# EAGLE board Yantronix_ECG_Alpha (EAGLE 5.10)
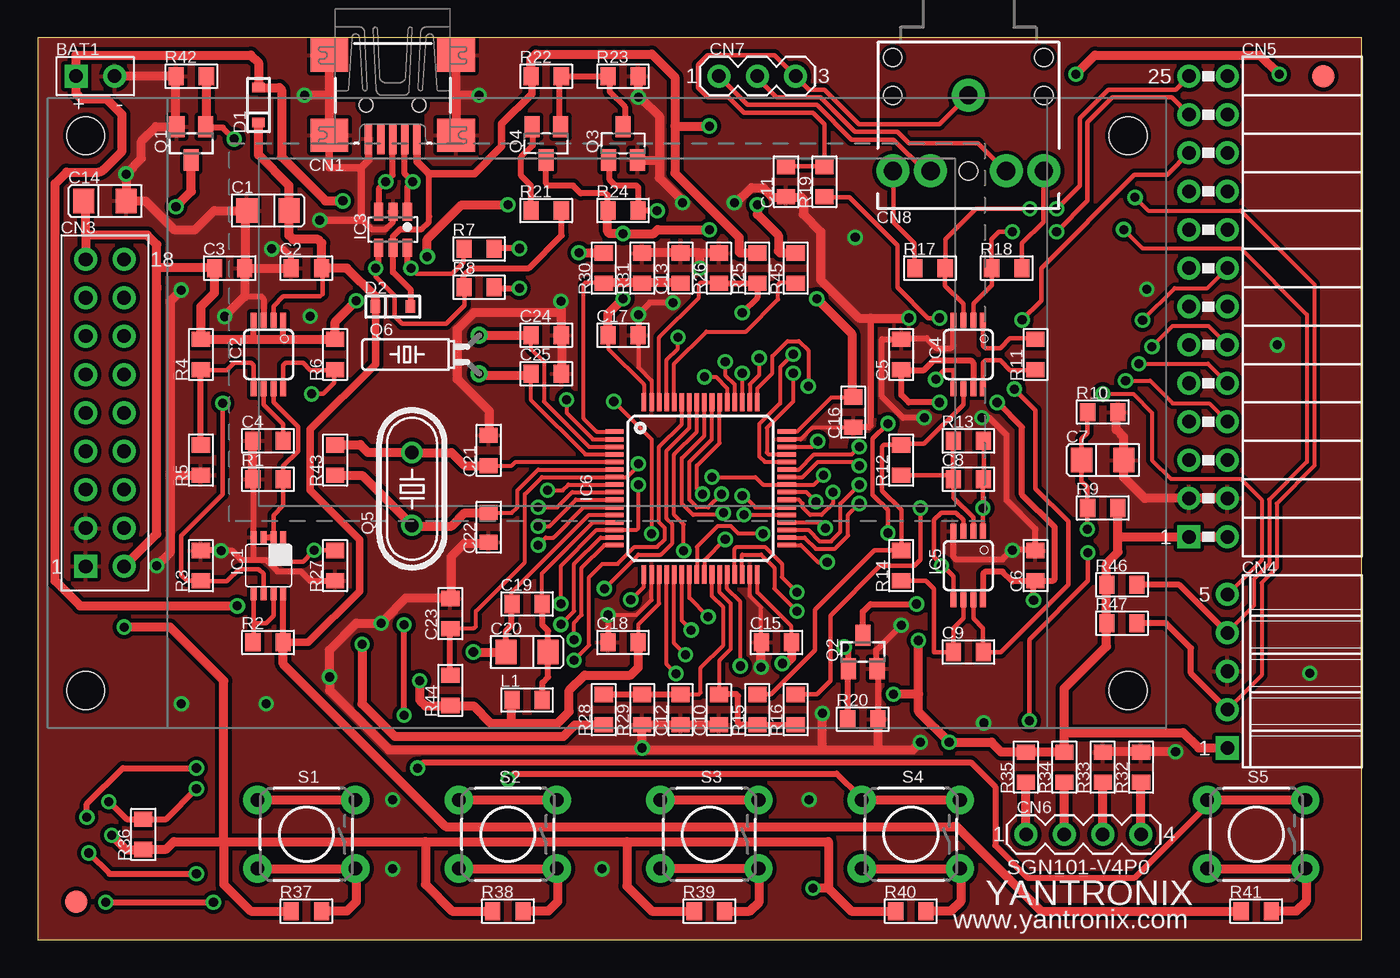
[diagram p2: board, top side]
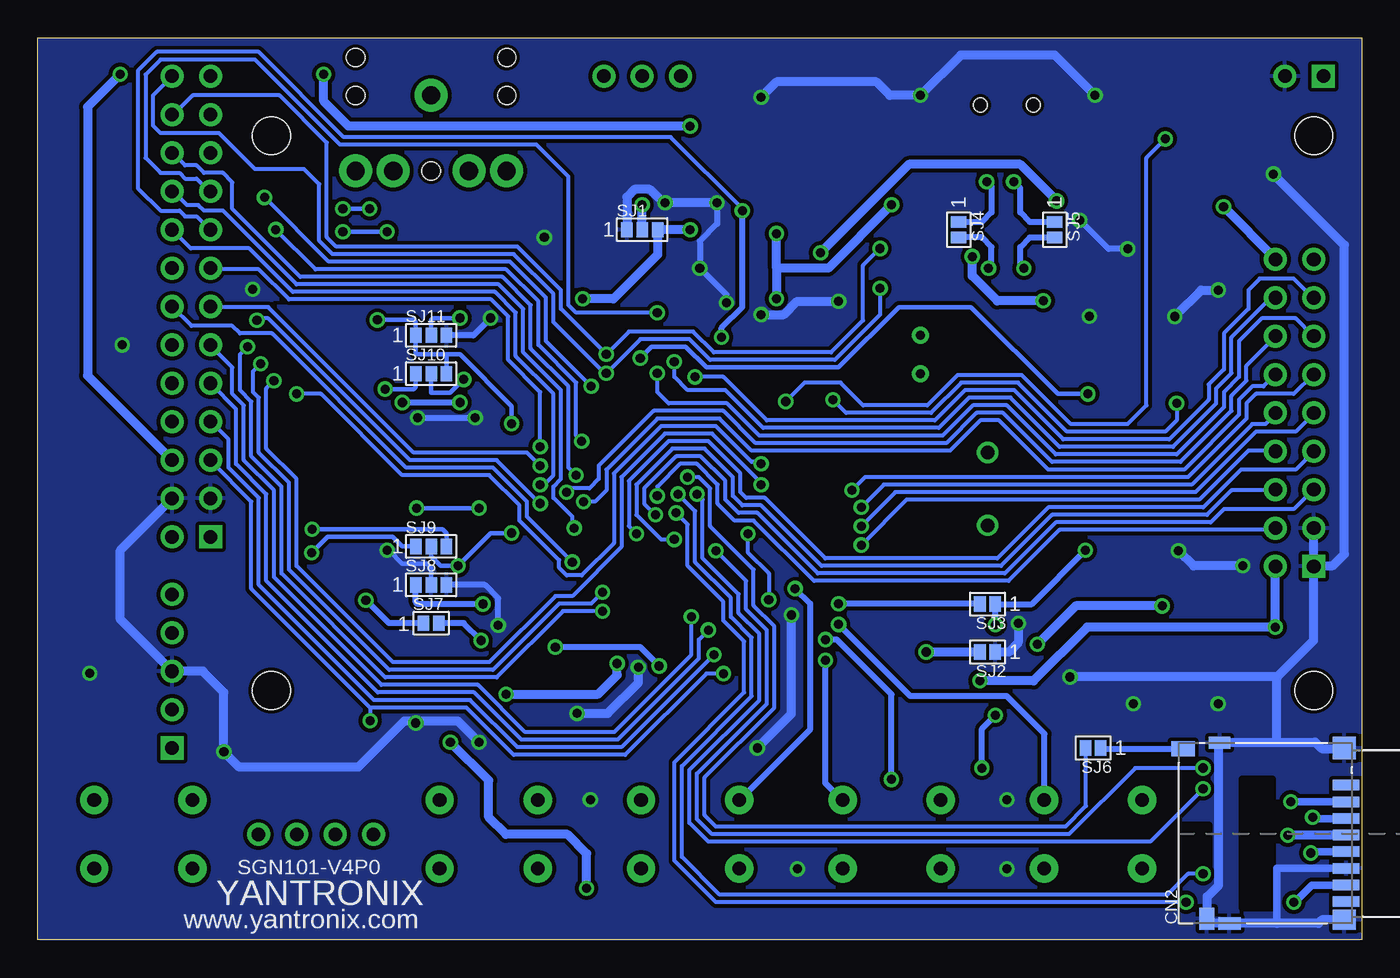
[diagram p3: board, bottom side, seen from below]

Size 87.63 x 59.69 mm. Coordinates in mm from the lower left corner, seen from the top.
Outline: 0,0 87.63,0 87.63,59.69 0,59.69 0,0
Copper layers (1*16): Top 0.035mm / dielectric 1.5mm / Bottom 0.035mm
Design rules "default *": minimum track width 10mil, minimum drill 0.6mm, track to track 8mil, track to pad 8mil, pad to pad 7mil, via to via 8mil, smd to smd 8mil, copper to edge 0mil, drill to drill 8mil, minimum pad ring 10mil, minimum via ring 8mil, stop-mask expansion 4mil, vias tented up to drill 0mil, thermal gap 10mil

## Footprints (pad centres in the part's own frame; a part is rotated, then mirrored left to right if it is on the bottom)
BATTERY = drill 0.9 pad 1.524 square: + 0,1.27 | drill 0.9 pad 1.524 round: - 0,-1.27
EIA3216 = smd 1.4 x 1.6: A 1.4,0; C -1.4,0
0805 = smd 1 x 1.2: 1 -1,0; 2 1,0
UX60-MB-5ST = smd 2 x 0.5: 1 2.25,1.6; 2 2.25,0.8; 3 2.25,0; 4 2.25,-0.8; 5 2.25,-1.6 | smd 2.2 x 2.5: M1 -3.3,-4.2; M2 -3.3,4.2; M3 2,4.2; M4 2,-4.2 | hole 0.9: 0,-1.75; 0,1.75
MICROSD-CONN-PUSH-PULL = smd 0.7 x 1.75: 1 7.7,-0.875; 2 6.6,-0.875; 3 5.5,-0.875; 4 4.4,-0.875; 5 3.3,-0.875; 6 2.2,-0.875; 7 1.1,-0.875; 8 0,-0.875 | smd 1.5 x 1.5: GND1 10.15,-0.75 | smd 1.3 x 1.5: GND2 -1.2,-0.75 | smd 0.8 x 1.4: GND3 10.5,7.5 | smd 0.8 x 1.5: GND4 -1.45,6.85 | smd 1 x 1.55: SW1 10.1,9.925 | smd 1.45 x 1: SW2 -1.125,8.35
LCD-CONN-128X64 = drill 0.9 pad 1.524 square: 1 0,8.2 | drill 0.9 pad 1.524 round: 2 2.54,8.2; 3 0,10.74; 4 2.54,10.74; 5 0,13.28; 6 2.54,13.28; 7 0,15.82; 8 2.54,15.82; 9 0,18.36; 10 2.54,18.36; 11 0,20.9; 12 2.54,20.9; 13 0,23.44; 14 2.54,23.44; 15 0,25.98; 16 2.54,25.98; 17 0,28.52; 18 2.54,28.52 | hole 2.5: 0,0; 69,0; 0,36.7; 69,36.7
FE05W = drill 0.9 pad 1.524 square: 1 5.08,0 | drill 0.9 pad 1.524 round: 2 2.54,0; 3 0,0; 4 -2.54,0; 5 -5.08,0
FE13-2W = drill 0.9 pad 1.524 square: 1 -15.24,1.27 | drill 0.9 pad 1.524 round: 2 -15.24,-1.27; 3 -12.7,1.27; 4 -12.7,-1.27; 5 -10.16,1.27; 6 -10.16,-1.27; 7 -7.62,1.27; 8 -7.62,-1.27; 9 -5.08,1.27; 10 -5.08,-1.27; 11 -2.54,1.27; 12 -2.54,-1.27; 13 0,1.27; 14 0,-1.27; 15 2.54,1.27; 16 2.54,-1.27; 17 5.08,1.27; 18 5.08,-1.27; 19 7.62,1.27; 20 7.62,-1.27; 21 10.16,1.27; 22 10.16,-1.27; 23 12.7,1.27; 24 12.7,-1.27; 25 15.24,1.27; 26 15.24,-1.27
MA04-1 = drill 0.9 pad 1.524 round: 1 -3.81,0; 2 -1.27,0; 3 1.27,0; 4 3.81,0
MA03-1 = drill 0.9 pad 1.524 round: 1 -2.54,0; 2 0,0; 3 2.54,0
AUDIO-JACK = drill 1.2 pad 2.184 round: 1 0,0; 2 5,-5; 3 5,5; 4 5,-2.5; 5 5,2.5 | hole 1.2: 0,5; -2.5,5; -2.5,-5; 0,-5; 5,0
SOD-323 = smd 0.63 x 0.83: A 1.15,0; K -1.15,0
DCT_R-PDSO-G8 = smd 0.4 x 0.8: 1 -0.975,-1.875; 2 -0.325,-1.875; 3 0.325,-1.875; 4 0.975,-1.875; 5 0.975,1.875; 6 0.325,1.875; 7 -0.325,1.875; 8 -0.975,1.875
MSOP08 = smd 0.4 x 1: 1 -0.976,-2.263; 2 -0.326,-2.263; 3 0.324,-2.263; 4 0.974,-2.263; 5 0.974,2.262; 6 0.324,2.262; 7 -0.326,2.262; 8 -0.976,2.262
SOT23-6 = smd 0.6 x 1.2: 1 -0.95,-1.2; 2 0,-1.2; 3 0.95,-1.2; 4 0.95,1.2; 5 0,1.2; 6 -0.95,1.2
TQFP64 = smd 1.2 x 0.3: 1 -5.7,3.75; 2 -5.7,3.25; 3 -5.7,2.75; 4 -5.7,2.25; 5 -5.7,1.75; 6 -5.7,1.25; 7 -5.7,0.75; 8 -5.7,0.25; 9 -5.7,-0.25; 10 -5.7,-0.75; 11 -5.7,-1.25; 12 -5.7,-1.75; 13 -5.7,-2.25; 14 -5.7,-2.75; 15 -5.7,-3.25; 16 -5.7,-3.75; 33 5.7,-3.75; 34 5.7,-3.25; 35 5.7,-2.75; 36 5.7,-2.25; 37 5.7,-1.75; 38 5.7,-1.25; 39 5.7,-0.75; 40 5.7,-0.25; 41 5.7,0.25; 42 5.7,0.75; 43 5.7,1.25; 44 5.7,1.75; 45 5.7,2.25; 46 5.7,2.75; 47 5.7,3.25; 48 5.7,3.75 | smd 0.3 x 1.2: 17 -3.75,-5.7; 18 -3.25,-5.7; 19 -2.75,-5.7; 20 -2.25,-5.7; 21 -1.75,-5.7; 22 -1.25,-5.7; 23 -0.75,-5.7; 24 -0.25,-5.7; 25 0.25,-5.7; 26 0.75,-5.7; 27 1.25,-5.7; 28 1.75,-5.7; 29 2.25,-5.7; 30 2.75,-5.7; 31 3.25,-5.7; 32 3.75,-5.7; 49 3.75,5.7; 50 3.25,5.7; 51 2.75,5.7; 52 2.25,5.7; 53 1.75,5.7; 54 1.25,5.7; 55 0.75,5.7; 56 0.25,5.7; 57 -0.25,5.7; 58 -0.75,5.7; 59 -1.25,5.7; 60 -1.75,5.7; 61 -2.25,5.7; 62 -2.75,5.7; 63 -3.25,5.7; 64 -3.75,5.7
FIDUCIAL-1.5X3 = smd 1.5 x 1.5: 1 0,0
SOT23 = smd 1 x 1.4: 1 -0.95,-1.1; 2 0.95,-1.1; 3 0,1.1
SOT23-BEC = smd 1 x 1.4: B -0.95,-1.1; C 0,1.1; E 0.95,-1.1
HC49/S = drill 0.9 round: 1 -2.413,0; 2 2.413,0
TC26H = drill 0.6 round: 1 -1.27,0; 2 1.27,0
TACTILE-PTH = drill 0.9 pad 1.88 round: 1 -3.251,2.261; 2 3.251,2.261; 3 -3.251,-2.261; 4 3.251,-2.261
SJ-2 = smd 0.762 x 1.016: 1 -1.016,0; 2 0,0; 3 1.016,0
SJ = smd 0.762 x 1.016: 1 -0.508,0; 2 0.508,0

## Placement (x,y rotation side)
BAT1  BATTERY  [BATTERY]  3.81,57.15 90 top
C1  10uF  [EIA3216]  15.24,48.26 0 top
C2  2.2uF  [0805]  17.78,44.45 180 top
C3  2.2uF  [0805]  12.7,44.45 0 top
C4  33nF  [0805]  15.24,33.02 180 top
C5  0.1uF  [0805]  57.15,38.73 90 top
C6  0.1uF  [0805]  66.04,24.77 90 top
C7  10uF  [EIA3216]  70.48,31.75 180 top
C8  0.01uF  [0805]  61.59,30.48 0 top
C9  0.1uF  [0805]  61.59,19.05 180 top
C10  0.1uF  [0805]  45.09,15.24 90 top
C11  0.1uF  [0805]  49.53,50.16 90 top
C12  0.1uF  [0805]  42.55,15.24 270 top
C13  0.1uF  [0805]  42.55,44.45 90 top
C14  10uF  [EIA3216]  4.45,48.9 180 top
C15  0.1uF  [0805]  48.9,19.68 180 top
C16  0.1uF  [0805]  53.98,34.92 270 top
C17  0.1uF  [0805]  38.73,40.01 0 top
C18  0.1uF  [0805]  38.73,19.68 180 top
C19  0.1uF  [0805]  32.38,22.23 180 top
C20  10uF  [EIA3216]  32.38,19.05 0 top
C21  27pF  [0805]  29.84,32.38 90 top
C22  27pF  [0805]  29.84,27.3 270 top
C23  0.1uF  [0805]  27.3,21.59 90 top
C24  6.8pF  [0805]  33.66,40.01 0 top
C25  6.8pF  [0805]  33.66,37.47 0 top
CN1  MINI-USB-SHIELD-UX60-MB-5ST  [UX60-MB-5ST]  23.5,55.24 270 top
CN2  DM3D-SF  [MICROSD-CONN-PUSH-PULL]  1.91,2.54 90 bottom
CN3  PL-E128649B  [LCD-CONN-128X64]  3.17,16.51 0 top
CN4  SWD  [FE05W]  78.74,17.78 270 top
CN5  EXT-CON  [FE13-2W]  77.47,41.91 90 top
CN6  PU-PD  [MA04-1]  69.22,6.99 0 top
CN7  RA-LA-RL  [MA03-1]  47.62,57.15 0 top
CN8  AUDIO-JACKPTH  [AUDIO-JACK]  61.59,55.88 270 top
D1  BAT60J  [SOD-323]  14.61,55.24 90 top
D2  BAT60J  [SOD-323]  23.5,41.91 0 top
IC1  SN74LVC2G02  [DCT_R-PDSO-G8]  15.28,24.77 180 top
IC2  LP3982IMM  [MSOP08]  15.28,38.73 180 top
IC3  USBLC6-2SC6  [SOT23-6]  23.51,46.99 180 top
IC4  AD623RM  [MSOP08]  61.59,38.73 180 top
IC5  AD8607RM  [MSOP08]  61.59,24.77 180 top
IC6  STM32F10XRXT6  [TQFP64]  43.88,29.88 0 top
JP1  FIDUCIAL1.5X3  [FIDUCIAL-1.5X3]  2.54,2.54 0 top
JP2  FIDUCIAL1.5X3  [FIDUCIAL-1.5X3]  85.09,57.15 0 top
L1  Ferrite Bead  [0805]  32.38,15.88 0 top
Q1  BSS123  [SOT23]  10.16,52.7 180 top
Q2  BSS123  [SOT23]  54.61,19.05 0 top
Q3  BC817-40SMD  [SOT23-BEC]  38.73,52.7 0 top
Q4  BC817-40SMD  [SOT23-BEC]  33.66,52.7 180 top
Q5  8MHz  [HC49/S]  24.77,29.84 90 top
Q6  32KHz  [TC26H]  29.21,38.73 90 top
R1  100K  [0805]  15.24,30.48 0 top
R2  100K  [0805]  15.24,19.68 0 top
R3  100K  [0805]  10.79,24.77 270 top
R4  140K  [0805]  10.79,38.73 90 top
R5  100K  [0805]  10.79,31.75 90 top
R6  100K  [0805]  19.68,38.73 90 top
R7  22R  [0805]  29.21,45.72 0 top
R8  22R  [0805]  29.21,43.18 0 top
R9  100K  [0805]  70.48,28.57 0 top
R10  100K  [0805]  70.48,34.92 180 top
R11  10K  [0805]  66.04,38.73 90 top
R12  1K  [0805]  57.15,31.75 90 top
R13  100K  [0805]  61.59,33.02 0 top
R14  1M  [0805]  57.15,24.77 90 top
R15  OPEN  [0805]  47.62,15.24 90 top
R16  100R  [0805]  50.16,15.24 90 top
R17  100K  [0805]  59.05,44.45 0 top
R18  100K  [0805]  64.14,44.45 180 top
R19  100K  [0805]  52.07,50.16 270 top
R20  100K  [0805]  54.61,14.61 180 top
R21  1K5  [0805]  33.66,48.26 0 top
R22  10K  [0805]  33.66,57.15 0 top
R23  36K  [0805]  38.73,57.15 0 top
R24  47K  [0805]  38.73,48.26 180 top
R25  15K  [0805]  47.62,44.45 270 top
R26  22K  [0805]  45.09,44.45 90 top
R27  100K  [0805]  19.68,24.77 90 top
R28  1M  [0805]  37.47,15.24 270 top
R29  1M  [0805]  40.01,15.24 90 top
R30  330K  [0805]  37.47,44.45 90 top
R31  680K  [0805]  40.01,44.45 270 top
R32  330R  [0805]  73.03,11.43 270 top
R33  330R  [0805]  70.48,11.43 270 top
R34  10K  [0805]  67.94,11.43 90 top
R35  10K  [0805]  65.41,11.43 90 top
R36  10K  [0805]  6.99,6.99 270 top
R37  10K  [0805]  17.78,1.91 0 top
R38  10K  [0805]  31.11,1.91 0 top
R39  10K  [0805]  44.45,1.91 0 top
R40  10K  [0805]  57.78,1.91 0 top
R41  33K  [0805]  80.64,1.91 0 top
R42  100K  [0805]  10.16,57.15 0 top
R43  1M  [0805]  19.68,31.75 90 top
R44  100K  [0805]  27.3,16.51 270 top
R45  10K  [0805]  50.16,44.45 90 top
R46  10K  [0805]  71.75,23.5 180 top
R47  10K  [0805]  71.75,20.95 180 top
S1  [TACTILE-PTH]  17.78,6.99 180 top
S2  [TACTILE-PTH]  31.11,6.99 180 top
S3  [TACTILE-PTH]  44.45,6.99 180 top
S4  [TACTILE-PTH]  57.78,6.99 180 top
S5  [TACTILE-PTH]  80.64,6.99 180 top
SJ1  [SJ-2]  47.62,46.99 0 bottom
SJ2  [SJ]  24.77,19.05 180 bottom
SJ3  [SJ]  24.77,22.23 180 bottom
SJ4  [SJ]  26.67,46.99 270 bottom
SJ5  [SJ]  20.32,46.99 270 bottom
SJ6  [SJ]  17.78,12.7 180 bottom
SJ7  [SJ]  61.59,20.95 0 bottom
SJ8  [SJ-2]  61.59,23.5 0 bottom
SJ9  [SJ-2]  61.59,26.04 0 bottom
SJ10  [SJ-2]  61.59,37.47 0 bottom
SJ11  [SJ-2]  61.59,40.01 0 bottom

## Tracks (layer width: path | path; a pad name or v marks a point on that pad's centre or on a via)
!SHDN
  Top 0.305: R1.2 16.26,30.48 | IC2.7 15.6,36.4 15.6,35.59 17.23,33.96 17.23,32.34 16.25,31.36 16.25,30.55 R1.2 | R1.2 16.25,30.39 16.25,28.76 15.6,28.11 IC1.2
  Top 0.381: IC1.2 15.44,26.65 15.11,26.65 IC1.3
CN4_5/RESET  (via drill 0.6)
  Top 0.254: C23.1 27.5,20.62 28.88,20.62 29,20.75 29,21.75 32.25,25 32.25,29.5 33.38,30.62 IC6.7 39,30.62 39.75,31.38 v39.75,31.5 | v70.5,36.12 72.5,36.12 73.75,34.88 73.75,31.75 75,30.5 79.62,30.5 81,29.12 81,25.12 78.75,22.88 CN4.5
  Top 0.406: C23.1 27.3,17.65 27.18,17.53 27.3,17.4 R44.1
  Bottom 0.254: v39.75,31.5 39.88,31.62 40.38,31.62 42.75,34 46.38,34 49.5,30.88 49.5,26.25 51.62,24.12 52.62,24.12 53.12,24.62 53.12,25.12 55.75,27.75 55.75,28.75 57.75,30.75 63.5,30.75 68.88,36.12 v70.5,36.12
CN5_21/V_GND  (via drill 0.6)
  Top 0.254: 74.75,50.62 74.8,50.67
  Top 0.305: 61.21,27.05 IC5.3 61.26,27.14 61.26,27.79 60.77,28.27 59.8,28.27 59.31,27.79 59.31,25.35 59.8,24.86 v59.82,24.77 59.96,24.7 60.61,24.05 60.61,22.59 IC5.5 | v56.26,26.92 56.26,28.45 55.24,29.46 55.24,33.15 v56.26,34.16 | 74.8,50.67 CN5.21 | v65.15,41.02 66.42,42.29 66.42,44.45 72.6,50.62 74.75,50.62
  Bottom 0.305: SJ9.2 61.59,25.4 60.96,24.77 v59.82,24.77 57.66,26.92 v56.26,26.92 | 60.58,38.73 SJ10.3 | 60.58,38.73 62.48,38.73 62.61,38.86 SJ11.1 62.61,40.89 62.74,41.02 v65.15,41.02 | 60.58,38.73 59.69,38.73 56.26,35.31 v56.26,34.16
CN5_23/IA_IN-  (via drill 0.6)
  Top 0.305: CN5.23 75.06,55.75 71.12,55.75 69.47,54.1 69.47,48.9 v67.44,46.86 | R18.2 63.12,44.58 | R18.2 63.12,44.7 | R18.2 63.12,44.83 | R18.2 63.12,44.96 63.12,46.35 63.63,46.86 v64.52,46.86 | R18.2 63.13,43.31 61.91,42.09 IC4.2
  Bottom 0.305: v64.52,46.86 v67.44,46.86
CN5_25/IA_IN+  (via drill 0.6)
  Top 0.305: CN5.25 75.31,56.26 70.87,56.26 68.96,54.36 68.96,49.91 v67.44,48.39 | R17.2 60.07,44.58 | R17.2 60.07,44.7 | R17.2 60.07,44.83 60.07,46.35 62.1,48.39 v65.66,48.39 | R17.2 60.05,43.3 61.26,42.09 IC4.3
  Bottom 0.305: v65.66,48.39 v67.44,48.39
CN8_1/CN7_3/RL
  Top 0.305: C11.2 49.53,51.18 52.07,51.18 R19.1 52.07,53.98 51.31,54.74 46.74,54.74 45.72,55.75 44.32,55.75 43.69,56.39 43.69,57.91 44.32,58.55 48.77,58.55 CN7.3 51.05,56.26 52.07,56.26 54.36,53.98 59.69,53.98 CN8.1 | C11.2 49.4,51.18 | C11.2 49.28,51.18 | C11.2 49.15,51.18
CN8_2/RA
  Top 0.305: R17.1 58.04,46.1 56.64,47.5 56.64,50.8 CN8.2
CN8_3/LA
  Top 0.305: R18.1 65.15,46.1 66.55,47.5 66.55,50.8 CN8.3
CN8_4/CN7_1/RA
  Top 0.305: CN8.4 59.05,50.93 58.67,50.93 56.64,52.96 53.85,52.96 51.56,55.24 46.99,55.24 CN7.1
CN8_5/CN7_2/LA
  Top 0.305: CN7.2 47.62,57.02 48.9,55.75 51.82,55.75 54.1,53.47 56.9,53.47 57.66,52.7 62.23,52.7 64.01,50.93 CN8.5
GND  (via drill 0.6)
  Top 0.254: IC6.63 40.62,37 39.75,37.88 39.75,39.88 C17.2 | C15.2 47.88,19.88 47.88,22 47.12,22.75 IC6.31 | IC6.18 40.62,22.5 39.62,21.5 v37.75,21.5 | IC6.47 50.5,33.12 51.25,33.88 53.88,33.88 C16.2
  Top 0.305: R1.1 14.22,30.48
  Top 0.381: IC2.3 14.95,41.11 14.95,42.41 14.79,42.58 13.7,42.58 | 14.3,25.15 IC1.4 14.3,30.23 R1.1
  Top 0.406: v57.15,20.83 55.5,19.18 55.5,18.03 Q2.2 55.63,17.78 55.63,14.73 R20.1 | R27.1 19.68,23.75 18.03,23.75 17.4,24.38 15.88,24.38 15.11,25.15 14.3,25.15 13.46,25.15 12.83,25.78 12.12,25.78 R3.1 | 21.4,47.62 21.46,47.62 21.61,47.5 22.09,47.02 23.04,47.02 23.51,47.5 23.51,47.98 IC3.2 | v15.49,45.72 16.26,45.72 16.76,45.21 16.76,44.83 C2.2 | v42.04,42.16 40.51,42.16 39.75,41.4 39.75,40.01 C17.2 | C16.2 53.98,33.91 54.99,33.91 55.12,34.04 55.12,41.15 | v37.75,21.5 37.75,19.75 C18.2
  Top 0.508: v18.67,47.62 21.4,47.62 21.4,51.1 | 21.4,51.1 21.9,51.6 21.9,52.9 CN1.5 | CN1.M4 19.3,53 19.3,51.1 21.4,51.1
  Top 0.61: C7.C | 71.5,34.92 R10.1 71.37,34.8 71.37,33.78 71.88,33.27 71.88,32 C7.C | C7.C 71.88,31.5 | C4.2 14.22,33.02 14.22,30.61 R1.1 | 10.79,30.73 R5.1 8.75,30.75 | C3.2 13.72,44.45 | C2.2 16.89,44.45 16.76,44.58 16.64,44.45 C3.2 | C3.2 13.72,44.7 13.72,48.26 C1.C 11.68,48.26 10.41,46.99 9.02,46.99 7.11,48.9 C14.C 5.84,49.15 v5.84,50.67 6.86,51.69 6.86,52.83 7.83,53.8 Q1.2 9.14,53.85 9.14,56.9 R42.1 | R42.1 9.14,57.15 | R42.1 BAT1.- | C24.2 C25.2 | R29.1 40.01,14.22 42.55,14.22 C12.2 42.8,14.22 45.09,14.22 C10.1 | R26.2 45.09,45.47 | R33.1 70.48,12.45 73.03,12.45 R32.1 73.28,12.45 v75.31,12.45 | C7.C 71.88,31.24 71.88,30.61 73.28,29.21 CN5.3 CN5.4 | C11.1 | C11.1 49.78,49.15 | R29.1 39.75,14.22 | v47.88,18.03 47.88,19.68 C15.2 | 55.63,14.48 R20.1 55.63,14.22 55.63,12.57 | CN1.M1 19.3,58.42 19.3,55.88 | 19.3,55.88 19.3,53.34 CN1.M4 | CN1.M3 27.69,53.34 27.69,55.88 | 27.69,55.88 27.69,58.42 CN1.M2 | 19.3,55.88 v17.65,55.88 | v29.21,55.88 27.69,55.88 | 39.75,57.15 R23.2 39.75,56.9 v39.75,55.75 40.01,55.63 41.15,54.48 41.15,51.56 | 39.75,51.56 Q3.E 40.01,51.56 41.15,51.56 | 40.01,45.47 R31.1 40.26,45.47 42.55,45.47 C13.2 42.8,45.47 43.81,45.47 | 41.15,51.56 41.15,50.42 42.67,48.9 v42.67,48.77 | R26.2 44.83,45.47 | C11.1 49.28,49.15 48.64,49.15 48.01,49.78 47.24,49.78 46.23,48.77 v46.1,48.77 | R26.2 44.58,45.47 43.81,45.47 | v43.81,44.45 43.81,45.47 | v57.66,41.15 55.12,41.15 54.36,41.15 51.82,43.69 51.82,46.86 50.67,48.01 50.67,49.02 50.55,49.15 50.04,49.15 C11.1 | 40.01,12.57 23.24,12.57 19.3,16.51 v19.3,17.4 19.3,19.18 21.08,20.95 v22.73,20.95 22.88,21.12 24.38,22.62 27.25,22.62 C23.2 27.38,22.88 27.38,25.38 28.25,26.25 29.75,26.25 C22.2
  Top 0.61: 40.01,12.57 51.94,12.57 | 51.94,12.57 55.63,12.57 | 40.01,12.57 v40.01,12.7 R29.1 | 51.94,12.57 v51.94,14.99 | 55.63,12.57 57.91,12.57 v58.42,13.08 | v12.12,25.75 12.12,25.78 | v12.38,41.25 13.7,42.58 C3.2 | v7.88,24.75 8.75,25.62 8.75,30.75 | v9.5,43 8.75,42.25 8.75,30.75 | C21.2 29.88,33.5 29.88,35 27.75,37.12 27.75,40.38 28.88,41.5 34.62,41.5 | C24.2 34.62,40.25 | 39.75,41.4 v39.75,41.38 | v34.62,42.25 34.62,41.5 | 34.62,41.5 34.62,40.5 C24.2
  Bottom 0.406: SJ8.3 58.04,23.5 57.15,22.61 v57.15,20.83 | SJ11.3 58.8,40.01 v57.66,41.15 | v18.67,47.62 16.76,45.72 v15.49,45.72 | v42.67,48.77 42.67,47.37 43.81,46.23 v43.81,44.45 42.04,42.67 v42.04,42.16
  Bottom 0.508: CN2.6 1.1,4.73 5.61,4.73 5.61,1.1
  Bottom 0.61: CN2.GND4 8.76,1.14 | CN2.GND3 9.4,13.08 | CN3.1 3.17,19.81 5.59,17.4 5.61,17.4 | v17.65,55.88 20.32,58.55 26.54,58.55 v29.21,55.88 31.24,55.88 32.13,56.77 38.73,56.77 v39.75,55.75 | SJ1.1 48.64,49.15 48.13,49.66 47.12,49.66 46.23,48.77 v46.1,48.77 v42.67,48.77 | CN5.4 82.17,25.78 82.17,21.21 CN4.3 76.71,17.78 75.31,16.38 v75.31,12.45 74.3,11.43 66.42,11.43 63.37,14.48 59.82,14.48 v58.42,13.08 | v37.75,21.5 37.75,14.96 v40.01,12.7 | v47.88,18.03 47.88,17.02 49.91,14.99 v51.94,14.99 | 5.61,17.4 v19.3,17.4 | SJ2.1 23.37,19.05 22.73,19.68 v22.73,20.95 | 5.84,50.55 v5.84,50.67 1.14,45.97 1.14,25.53 1.91,24.77 2.92,24.77 CN3.1 | v7.88,24.75 11.12,24.75 v12.12,25.75 | v12.38,41.25 10.62,43 v9.5,43 | v34.62,42.25 37.38,42.25 38.25,41.38 v39.75,41.38 | CN2.GND2 1.21,1.32 2.64,1.32 2.86,1.1 5.61,1.1 8.47,1.1 CN2.GND4 | CN2.GND4 9.02,1.1 | CN2.GND1 1.21,12.65 2.64,12.65 3.08,13.09 5.61,13.09 | 5.61,13.09 9.13,13.09 CN2.GND3 | 5.61,13.09 5.61,17.4 | CN2.GND4 9.24,1.1 10.23,1.1 10.23,1.32 CN2.SW2 10.23,1.65 10.23,2.86 9.46,3.63 9.46,12.76 CN2.GND3 | CN3.1 CN3.3
  other vias: 15.11,15.62 51.05,9.27 37.34,4.7 23.5,9.27 23.5,4.7 82.04,39.37 18.03,41.27 73.41,43.05 62.61,14.35 9.5,15.63 84.2,17.65 54.1,46.48
  pour Top (isolate 0.254, rank 2): 0.13,59.56 87.5,59.56 87.5,0.13 0.13,0.13
  pour Bottom (isolate 0.254, rank 2): 0.13,59.56 87.5,59.56 87.5,0.13 0.13,0.13
GNDA  (via drill 0.6)
  Top 0.305: C6.2
  Top 0.381: C5.2 57.2,39.81 58.83,39.81 59.48,39.16 60.45,39.16 60.61,39.33 60.61,40.95 IC4.4 | IC5.4 60.61,26.98 60.61,25.35 60.77,25.19 63.86,25.19 64.51,25.84 v64.52,25.78 64.67,25.84 65.97,25.84 C6.2
  Top 0.406: C6.2 66.04,27.18 64.14,29.08 64.14,33.4 62.99,34.54 v62.48,34.54 | v58.67,34.54 57.28,34.54 55.88,35.94 55.88,39.75 57.02,39.75 C5.2
  Bottom 0.305: SJ8.2 61.59,24.64 61.85,24.89 63.5,24.89 64.39,25.78 v64.52,25.78
  Bottom 0.406: v62.48,34.54 v58.67,34.54
  pour Top (isolate 0.254): 55.63,40.89 62.61,40.89 62.61,36.07 65.15,33.53 65.15,29.46 67.31,27.3 67.31,23.5 66.04,22.23 57.4,22.23 55.63,24
  pour Bottom (isolate 0.254): 54.61,32.51 54.61,36.2 56.77,38.35 56.77,41.4 57.66,42.29 70.61,42.29 70.74,42.16 70.87,42.04 70.99,41.91 72.14,41.91 70.87,40.64 62.74,32.51
  pour Bottom (isolate 0.254): 51.56,23.75 53.98,26.16 55.63,27.81 55.63,28.96 57.66,30.99 63.5,30.99 63.63,30.86 66.8,27.69 70.48,27.69 70.48,24.77 64.14,18.41 57.78,18.41 57.66,18.41 53.34,22.73 52.2,22.73 52.2,22.86 51.44,23.62
N$1
  Top 0.305: IC2.6 14.95,36.4 14.95,35.42 16.25,34.12 16.25,33.15 C4.1
N$2
  Top 0.305: 14.3,20.96 14.3,19.82 R2.1 | 14.3,20.96 IC1.5 | 14.3,20.96 15.11,20.96 15.6,21.45 IC1.7
N$3
  Top 0.305: IC2.5 14.3,36.56 14.3,38.02 14.14,38.19 13,38.19 12.51,37.7 10.89,37.7 R4.1
  Top 0.406: R5.2 10.79,32.64 10.67,32.77 10.79,32.89 10.79,37.59 10.67,37.72 10.79,37.85 R4.1
N$4  (via drill 0.6)
  Top 0.406: IC3.1 24.46,48.21 24.46,49.81 v24.82,50.16 24.3,50.69 CN1.2
  Bottom 0.406: SJ4.1 25.15,47.5 24.51,48.13 24.51,49.02 24.51,49.86 v24.82,50.16
N$5  (via drill 0.6)
  Top 0.406: IC3.3 22.56,48.21 22.56,49.7 v23.03,50.16 23.5,50.63 CN1.3
  Bottom 0.406: SJ5.1 21.97,47.5 22.61,48.13 22.61,49.02 22.61,49.74 v23.03,50.16
N$6  (via drill 0.6)
  Top 0.305: R7.1 28.19,45.72 28.19,44.83 27.43,44.07 25.08,44.07 v24.7,44.45
  Top 0.406: IC3.6 24.46,45.6 24.46,44.69 v24.7,44.45
  Bottom 0.406: SJ4.2 25.15,46.48 24.51,45.85 24.51,44.58 24.64,44.45 v24.7,44.45
N$7
  Top 0.305: IC4.1 62.56,40.95 62.56,39.33 62.73,39.16 63.7,39.16 64.35,39.81 65.97,39.81 R11.2
N$8
  Top 0.305: IC4.8 62.56,36.56 62.56,38.19 62.73,38.35 63.7,38.35 64.35,37.7 65.97,37.7 R11.1
N$9
  Top 0.61: S1.2 14.61,4.7 20.95,4.7 S1.1 21.08,4.45 21.08,2.54 20.45,1.91 18.92,1.91 18.8,2.03 18.67,1.91 R37.2
N$10
  Top 0.61: S2.2 27.94,4.7 34.29,4.7 S2.1 34.42,4.45 34.42,2.54 33.78,1.91 32.26,1.91 32.13,2.03 32,1.91 R38.2
N$11
  Top 0.305: 47.62,16.26 R15.2 47.75,16.26 48.51,16.26 51.44,19.18 51.44,21.84 55.37,25.78 56.9,25.78 R14.2 57.15,25.65 57.02,25.78 57.15,25.91 57.15,28.45 55.88,29.72 55.88,32.64 56.01,32.77 57.02,32.77 R12.2 57.2,32.83 58.66,32.83 61.26,35.42 61.26,36.4 IC4.6
N$12
  Top 0.305: R13.1 C8.1 | C8.1 60.45,30.73 57.15,30.73 R12.1 | C8.1 60.61,30.39 60.61,29.25 61.91,27.95 61.91,27.14 IC5.2
N$13
  Top 0.305: R14.1 57.15,23.75 58.8,23.75 59.31,23.24 59.31,19.05 C9.2 60.61,19.18 60.61,20.64 61.26,21.29 61.26,22.43 IC5.6
N$14  (via drill 0.6)
  Top 0.305: v64.64,36.45 66.04,35.05 66.04,29.84 68.2,27.69 68.2,23.5 63.75,19.05 C9.1 62.56,19.18 62.56,20.64 61.91,21.29 61.91,22.43 IC5.7
  Bottom 0.305: v64.64,36.45 62.74,36.45 62.61,36.58 SJ10.1
N$15  (via drill 0.6)
  Top 0.305: IC4.5 60.61,36.56 60.61,37.7 59.96,37.7 59.48,37.21 v59.44,37.08
  Bottom 0.305: v59.44,37.08 60.33,36.2 61.59,36.2 SJ10.2
N$16  (via drill 0.6)
  Top 0.305: R13.2 62.61,33.02 62.61,30.48 C8.2 62.56,30.39 v62.56,28.57 62.56,27.14 IC5.1 | 50.16,16.26 R16.2 50.29,16.26 51.56,16.26 52.45,17.14 52.45,21.46 55.75,24.77 58.04,24.77 58.42,25.15 v58.42,28.57
  Bottom 0.305: v58.42,28.57 v62.56,28.57
N$17
  Top 0.61: S3.2 41.27,4.7 47.62,4.7 S3.1 47.75,4.45 47.75,2.54 47.12,1.91 45.59,1.91 45.47,2.03 45.34,1.91 R39.2
N$18  (via drill 0.6)
  Top 0.305: R10.2 69.47,34.92 69.47,33.53 69.09,33.15 69.09,31.88 C7.A 69.09,30.35 69.47,29.97 69.47,28.57 R9.1 69.47,28.45 v69.47,27.18
  Bottom 0.305: SJ9.3 60.58,26.92 60.83,27.18 v69.47,27.18
N$19  (via drill 0.6)
  Top 0.406: Q2.3 54.61,21.72 55.12,22.23 v58.17,22.23
  Bottom 0.406: v58.17,22.23 62.48,22.23 62.61,22.35 SJ8.1
N$20
  Top 0.406: 34.54,57.15 34.67,57.28 34.8,57.15 37.59,57.15 37.72,57.28 37.85,57.15 | 34.54,57.15 R22.2 | 34.54,57.15 34.54,53.85 Q4.B | Q3.C 38.86,53.85 38.86,55.12 37.85,56.13 37.85,57.15 | 37.85,57.15 R23.1
N$21
  Top 0.61: S4.2 54.61,4.7 60.96,4.7 S4.1 61.09,4.45 61.09,2.54 60.45,1.91 58.93,1.91 58.8,2.03 58.67,1.91 R40.2
N$22  (via drill 0.6)
  Top 0.305: R19.2 53.72,49.15 56.9,45.97 56.9,43.18 58.93,41.15 v59.69,41.15
  Bottom 0.305: v59.69,41.15 61.47,41.15 61.59,41.02 SJ11.2
N$23
  Top 0.406: R21.1 32.64,48.26 32.64,49.91 32,50.55 32,51.82 32.77,52.58 32.77,53.72 Q4.E
N$25
  Top 0.61: S5.2 77.47,4.7 83.82,4.7 S5.1 83.95,4.45 83.95,2.54 83.31,1.91 81.79,1.91 81.66,2.03 81.53,1.91 R41.2
N$28
  Top 0.254: C22.1 30.12,28.25 31.38,28.25 31.75,28.62 31.75,29.75 33.12,31.12 IC6.6
  Top 0.61: R43.1 19.68,30.73 21.46,30.73 Q5.1 25,27.38 27.38,27.38 28.25,28.25 29.75,28.25 C22.1
N$29
  Top 0.254: R45.1 50.12,43.5 49.12,43.5 49,43.38 49,42.38 46.88,40.25 44.25,40.25 42.12,38.12 IC6.60
N$30
  Top 0.254: C21.1 30.12,31.38 31.38,31.38 31.62,31.62 IC6.5
  Top 0.61: R43.2 19.68,32.77 21.34,32.77 21.84,32.26 Q5.2 25,32.25 27.38,32.25 28.25,31.38 29.75,31.38 C21.1
N$43  (via drill 0.6)
  Top 0.61: R45.2 50.16,45.47 49.15,45.47 49.02,45.59 49.02,46.61 47.62,48.01 v47.62,48.64 47.62,48.77
  Bottom 0.61: SJ1.2 v47.62,48.64
N$47
  Bottom 0.406: CN2.SW1 11.88,12.62 17.12,12.62 17.25,12.5 17.38,12.62 SJ6.1
N$62  (via drill 0.6)
  Top 0.61: Q1.3 10.16,49.53 v9.14,48.51
  Bottom 0.61: v9.14,48.51 5.71,45.09 CN3.18
PA0-CN5_8/POWER_BUT  (via drill 0.6)
  Top 0.254: v34.62,22.25 34.62,24.75 37,27.12 IC6.14 39.62,27.12 39.75,27.25 v39.75,30.12 | CN5.8 77.53,35.5 75.12,35.5 73.62,37 v72,37
  Bottom 0.254: SJ3.2 25.38,22.25 | v39.75,30.12 39.75,30.25 43,33.5 46.12,33.5 49,30.62 49,26 52.25,22.75 53.38,22.75 57.75,18.38 64.12,18.38 70.5,24.75 70.5,30.5 72.5,32.5 72.5,36.5 v72,37
  Bottom 0.406: SJ3.2 25.25,22.25 | SJ3.2 25.12,22.38 | SJ3.2 25.5,22.25 v34.62,22.25
PA1-MENU_BUT  (via drill 0.6)
  Top 0.254: v34.62,20.88 35.5,21.75 35.5,24.88 37.25,26.62 IC6.15
  Top 0.61: S1.4 14.61,9.27 20.95,9.27 S1.3
  Bottom 0.254: S1.3 21.12,9.25
  Bottom 0.406: v34.62,20.88 29.88,16.12 25,16.12 25,16.13 23.5,16.13 21,13.63 21,9.25 S1.3
PA2-OK_BUT  (via drill 0.6)
  Top 0.254: IC6.16 37.5,26.12 36,24.62 36,21.5 35.5,21 v35.5,19.88
  Top 0.406: S4.4 54.38,9.5 52.88,11 31.5,11 v31.12,10.62
  Top 0.61: S4.4 54.61,9.27 60.96,9.27 S4.3
  Bottom 0.406: v35.5,19.88 34.75,19.88 31.12,16.25 v31.12,10.62
PA3-LCD_BACKLIGHT  (via drill 0.6)
  Top 0.254: Q1.1 11.12,53.5 | IC6.17 40.12,23.38 v39.25,22.5 | v40.62,26.88 40.62,33.12 v38.12,35.62
  Top 0.406: 11.38,53.75 Q1.1 11.5,53.75 12.25,53.75 v13,53
  Top 0.61: Q1.1 11.18,53.85 11.18,57.15 R42.2
  Bottom 0.254: v38.12,35.62 36.88,36.88 34.5,36.88 33,35.38 28.75,35.38 26.75,37.38 22.5,37.38 19.25,34.12 15.5,34.12 14.25,35.38 14.25,51.75 v13,53 | v40.62,26.88 40.64,26.8 40.64,25.65 39.24,24.26 39.24,22.61 v39.25,22.5
PA4-CN5_5/DAC1_OUT  (via drill 0.6)
  Top 0.254: IC6.20 41.62,18.25 v42.25,17.62
  Top 0.305: v69.5,25.62 69.5,23.75 65.62,19.88 v65.62,14.5
  Bottom 0.254: v42.25,17.62 43.38,17.62 48.75,12.25 56.12,12.25 59.25,15.38 65.62,15.38 | 65.62,15.38 73.5,23.25 73.5,29 76.12,31.62 CN5.5 | 65.62,15.38 v65.62,14.5
  Bottom 0.305: v69.5,25.62 69.47,25.65 68.45,26.67 64.14,26.67 63.5,26.04 SJ9.1
PA5-CN5_7  (via drill 0.6)
  Top 0.254: IC6.21 42.12,19.62 v42.88,18.88
  Bottom 0.254: v42.88,18.88 49,12.75 55.88,12.75 59,15.88 65.38,15.88 73,23.5 73,29.25 75,31.25 75,33.12 76.12,34.25 CN5.7
PA6-CN5_9  (via drill 0.6)
  Top 0.254: v43.25,20.5 42.62,21.12 IC6.22
  Bottom 0.254: v43.25,20.5 43.88,19.88 43.88,18.62 49.25,13.25 55.62,13.25 58.75,16.38 65.12,16.38 72.5,23.75 72.5,29.5 74.5,31.5 74.5,35.12 76.12,36.75 CN5.9
PA7-CN5_11  (via drill 0.6)
  Top 0.254: IC6.23 43.12,22.62 v44.38,21.38
  Bottom 0.254: v44.38,21.38 44.38,18.88 49.5,13.75 55.38,13.75 58.5,16.88 64.88,16.88 72,24 72,29.75 74,31.75 74,35.38 74.75,36.12 74.75,37.88 76.12,39.25 CN5.11
PA8-CN5_22/SD_DETECT  (via drill 0.6)
  Top 0.254: v44.62,30.62 47.5,30.62 48,30.12 IC6.41 51.38,30.12 v52,30.75
  Bottom 0.254: SJ6.2 18.25,12.62 18.25,8.88 19.62,7.5 42.75,7.5 43.5,8.25 43.5,10.75 38.88,15.38 38.88,20.75 40.25,22.12 40.25,24.5 43.12,27.38 43.12,29.88 43.88,30.62 v44.62,30.62 | CN5.22 78.62,52 77.88,51.25 77.12,51.25 76.62,50.75 75.38,50.75 74.75,50.12 74.75,48.38 70.25,43.88 56.88,43.88 55,42 55,39.12 52.5,36.62 52.5,31.25 v52,30.75
PA9-CN5_13  (via drill 0.6)
  Top 0.254: IC6.42 50.62,30.62 51.62,31.62 54.12,31.62 v54.38,31.38
  Bottom 0.254: CN5.13 76.12,41.88 72.38,41.88 62.75,32.25 55.25,32.25 v54.38,31.38
PA10-CN5_15  (via drill 0.6)
  Top 0.254: IC6.43 50.38,31.12 51.38,32.12 53.88,32.12 v54.38,32.62
  Bottom 0.254: CN5.15 76.12,44.38 73,44.38 71,42.38 57.62,42.38 56.5,41.25 56.5,38.38 54.38,36.25 v54.38,32.62
PA11-CN5_24/USBDM  (via drill 0.6)
  Top 0.254: IC6.44 48.12,31.62 47.75,32 47.75,34.12 49.12,35.5 49.12,37.88 v50,38.75
  Top 0.406: R7.2 30.12,45.75 30.25,45.88 30.38,45.75 v31.88,45.75
  Bottom 0.254: v31.88,45.75 33,44.62 33,41 35.12,38.88 42.88,38.88 44.25,40.25 48.5,40.25 v50,38.75 53,41.75 53,43 55.88,45.88 67.88,45.88 68.5,46.5 68.5,52.75 71.62,55.88 77.38,55.88 78.62,54.62 CN5.24
PA12-CN5_26/USBDP  (via drill 0.6)
  Top 0.254: IC6.45 48.38,32.12 48.25,32.25 48.25,33.88 50,35.62 v50,37.5
  Top 0.406: 30.38,43.12 30.25,43 30.12,43.12 R8.2 30.5,43.12 v31.88,43.12
  Bottom 0.254: v31.88,43.12 31.88,41.38 34.88,38.38 43.12,38.38 44.5,39.75 47.75,39.75 v50,37.5 50.12,37.5 53.5,40.88 53.5,42.75 56.12,45.38 68.12,45.38 69,46.25 69,50 70,51 73.25,51 75.62,53.38 79.5,53.38 80,53.88 80,55.88 78.75,57.12 CN5.26
PA13-CN4_4/SWDIO  (via drill 0.6)
  Top 0.254: v51.62,33 51.25,32.62 IC6.46 | v71.88,47 73.12,45.75 79.62,45.75 84,41.38 84,31.62 81.5,29.12 81.5,24.88 80.5,23.88 80.5,22.12 78.75,20.38 CN4.4
  Top 0.406: R46.1 72.64,23.5 72.77,23.62 72.9,23.5 75.56,23.5 CN4.4
  Bottom 0.254: v51.62,33 52,33.38 52,36.88 54.5,39.38 54.5,42.25 56.62,44.38 69.25,44.38 v71.88,47
PA14-CN4_2/SWCLK  (via drill 0.6)
  Top 0.254: IC6.49 47.62,36.5 48.62,37.5 48.62,38.62 49.62,39.62 50.38,39.62 51,39 v51,36.62 | v72.62,49.12 73.5,48.25 79.62,48.25 84.5,43.38 84.5,31.38 82,28.88 82,24.62 81,23.62 81,17.5 CN4.2
  Top 0.406: 72.77,20.83 R47.1 72.64,20.95 72.77,21.08 72.9,20.95 74.68,20.95 76.33,19.3 76.33,17.65 CN4.2
  Bottom 0.254: v51,36.62 54,39.62 54,42.5 56.38,44.88 68.38,44.88 v72.62,49.12
PA15-!FAULT  (via drill 0.6)
  Top 0.254: v47.75,38.5 47.75,37.38 47.12,36.75 IC6.50
  Top 0.305: v18.12,36.12 18.88,36.12 19.62,36.88 19.62,37.62 R6.1 19.5,37.7 18.04,37.7 17.55,38.19 16.41,38.19 16.25,38.02 16.25,36.56 IC2.8
  Bottom 0.305: v18.12,36.12 20.12,36.12 25.88,41.88 30.62,41.88 34.62,37.88 43.38,37.88 44.75,39.25 47,39.25 v47.75,38.5
PB0-VBAT_VD
  Top 0.254: IC6.26 44.62,22.75 45.38,22 45.38,19.5 43.88,18 43.88,16.38 43.75,16.25 42.75,16.25 C12.1
  Top 0.406: C12.1 42.42,16.26 40.01,16.26 R29.2 39.88,16.26 37.47,16.26 R28.1
PB1-IA_OUT/OA_OUT
  Top 0.254: IC6.27 45.12,23 45.88,22.25 45.88,19.25 45.12,18.5 45.12,16.38 C10.2
  Top 0.406: R16.1 50.16,14.22 47.62,14.22 R15.1 47.5,14.22 46.48,14.22 46.35,14.35 46.35,16.13 46.23,16.26 45.09,16.26 C10.2
PB2-GNDA_SHDN  (via drill 0.6)
  Top 0.254: Q2.1 53.62,18.12 | v46.5,18.12 46.5,22.38 45.62,23.25 IC6.28
  Top 0.406: R20.2 53.59,14.73 53.59,17.78 Q2.1 53.62,18.25 53.62,19.12 v53.38,19.38
  Bottom 0.406: v53.38,19.38 47.75,19.38 v46.5,18.12
PB3-SD_SCK  (via drill 0.6)
  Top 0.254: IC6.55 44.62,33.12 43.12,31.62 43.12,29.12 43.62,28.62 44.38,28.62 v45.25,29.5
  Top 0.406: v10.5,4.38 4.75,4.38 v3.38,5.75
  Bottom 0.254: v10.5,4.38 11.5,4.38 12.88,3 42.5,3 45,5.5 45,11.5 40.38,16.12 40.38,20 41.75,21.38 41.75,22.62 44.12,25 44.12,28.38 v45.25,29.5
  Bottom 0.508: v3.38,5.75 3.3,5.83 1.1,5.83 CN2.5
PB4-SD_MISO  (via drill 0.6)
  Top 0.254: IC6.56 44.12,33.38 42.62,31.88 42.62,28.88 43.38,28.12 45.25,28.12 v45.38,28.25
  Top 0.406: v4.5,2.5 v11.62,2.5
  Bottom 0.254: v11.62,2.5 42.75,2.5 45.5,5.25 45.5,11.75 40.88,16.38 40.88,19.75 42.25,21.12 42.25,22.38 44.62,24.75 44.62,27.5 v45.38,28.25
  Bottom 0.508: v4.5,2.5 4.4,2.53 3.3,3.63 1.1,3.63 CN2.7
PB5-SD_MOSI  (via drill 0.6)
  Top 0.254: IC6.57 43.62,33.62 42.12,32.12 42.12,28.12 42.75,27.5 v42.75,25.75
  Top 0.406: v3.25,8.12 3.25,9 5.62,11.38 v10.5,11.38
  Bottom 0.254: v10.5,11.38 15,11.38 19.38,7 43,7 44,8 44,11 39.38,15.62 39.38,20.5 40.75,21.88 40.75,23.75 v42.75,25.75
  Bottom 0.508: v3.25,8.12 3.19,8.03 1.1,8.03 CN2.3
PB6-DOWN_BUT  (via drill 0.6)
  Top 0.254: IC6.58 43.12,33.88 41.62,32.38 41.62,27.88 42,27.5 42,26.25 41.25,25.5 39.75,25.5 v37.5,23.25
  Top 0.61: S3.4 41.27,9.27 47.62,9.27 S3.3
  Bottom 0.406: v37.5,23.25 36.5,22.25 36.5,13.94 S3.4
PB7-UP_BUT  (via drill 0.6)
  Top 0.254: IC6.59 42.62,34.12 41.12,32.62 41.12,27.62 41.5,27.25 41.5,26.5 41,26 39.5,26 38.38,24.88 37.38,24.88 36.5,24 36.5,19.5 v35.5,18.5
  Top 0.61: S2.4 27.94,9.27 34.29,9.27 S2.3
  Bottom 0.406: S2.3 35.5,10.38 v35.5,18.5
PB8-CN5_17/USB_DISC  (via drill 0.6)
  Top 0.254: IC6.61 41.62,38.38 42.38,39.12 v42.38,39.88 | 39.75,49.78 39.75,49.62
  Top 0.406: Q3.B 37.85,51.56 37.85,50.29 38.23,49.91 39.62,49.91 39.75,49.78 39.75,48.26 R24.1 39.88,48.25 v41,48.25
  Bottom 0.254: v41,48.25 41,48.38 45.75,53.12 67.38,53.12 73,58.75 79.75,58.75 81,57.5 81,49.75 79.5,48.25 78.25,48.25 77.88,47.88 77.12,47.88 76.25,47 CN5.17
  Bottom 0.406: v41,48.25 41,41.88 42.38,40.5 v42.38,39.88
PB9-CN5_19/USB_P  (via drill 0.6)
  Top 0.254: R26.1 45,43.5 43.88,43.5 43.75,43.38 43.75,42.5 41.12,39.88 IC6.62
  Top 0.406: R26.1 45.09,43.43 47.62,43.43 R25.2 47.62,42.5 v46.62,41.5
  Bottom 0.254: v46.62,41.5 52,41.5 52.5,42 52.5,50.5 54.62,52.62 67.62,52.62 73.25,58.25 79.5,58.25 80.5,57.25 80.5,51.75 79.5,50.75 78.25,50.75 77.88,50.38 77.12,50.38 76.25,49.5 CN5.19
PB10-CN5_10  (via drill 0.6)
  Top 0.254: IC6.29 46.12,25.88 46.25,26 48.12,26 49.25,24.88 49.25,24 v50.25,23 | CN5.10 77.44,38.12 v72.88,38.12
  Bottom 0.254: v50.25,23 51,22.25 53.12,22.25 57.5,17.88 64.38,17.88 71,24.5 71,30.25 73,32.25 73,35.88 73.38,36.25 73.38,37.62 v72.88,38.12
PB11-CN5_12  (via drill 0.6)
  Top 0.254: IC6.30 46.62,25.5 47.88,25.5 48.75,24.62 48.75,23.25 v50.25,21.75 | v73.75,39.25 75.12,40.62 77.48,40.62 CN5.12
  Bottom 0.254: v50.25,21.75 52.88,21.75 57.25,17.38 64.62,17.38 71.5,24.25 71.5,30 73.5,32 73.5,35.62 74.25,36.38 74.25,38.75 v73.75,39.25
PB12-CN5_14  (via drill 0.6)
  Top 0.254: IC6.33 50.5,26.12 51.62,25 v52.25,25
  Bottom 0.254: CN5.14 77.45,40.62 74.75,40.62 74.25,40.12 72.12,40.12 63.25,31.25 57.5,31.25 55.25,29 55.25,28 v52.25,25
PB13-CN5_16  (via drill 0.6)
  Top 0.254: IC6.34 50.75,26.62 51.5,25.88 52.75,25.88 53.62,26.75 53.62,28.12 v54.38,28.88 | CN5.16 77.42,43.12 75.25,43.12 v73.12,41
  Bottom 0.254: v73.12,41 73,41.12 72.38,41.12 63,31.75 57.25,31.75 v54.38,28.88
PB14-CN5_18  (via drill 0.6)
  Top 0.254: IC6.35 51,27.12 51.75,26.38 52.5,26.38 53.12,27 53.12,28.88 v54.38,30.12
  Bottom 0.254: CN5.18 77.5,45.75 73.62,45.75 70.75,42.88 57.38,42.88 56,41.5 56,38.62 53.5,36.12 53.5,30.75 54.25,30 v54.38,30.12
PB15-CN5_20  (via drill 0.6)
  Top 0.254: v52.12,27.25 51.75,27.62 IC6.36
  Bottom 0.254: CN5.20 78.62,49.5 77.75,48.62 77,48.62 76.62,48.25 75.38,48.25 70.5,43.38 57.12,43.38 55.5,41.75 55.5,38.88 53,36.38 53,30.5 53.5,30 53.5,29.25 52.25,28 52.25,27.38 v52.12,27.25
PC0-LCD_DB0  (via drill 0.6)
  Top 0.254: IC6.8 35.12,30.12 34.75,29.75 v33.75,29.75
  Bottom 0.254: v33.75,29.75 32.88,30.62 11.5,30.62 7.62,34.5 7.62,35.5 7,36.12 4.5,36.12 3.21,37.41 CN3.11
PC1-LCD_DB1  (via drill 0.6)
  Top 0.254: IC6.9 35.38,29.62 34.38,28.62 v33.12,28.62
  Bottom 0.254: v33.12,28.62 31.62,30.12 11.25,30.12 7.25,34.12 6.38,34.12 5.75,34.75 CN3.10
PC2-LCD_DB2  (via drill 0.6)
  Top 0.254: IC6.10 35.62,29.12 33.88,27.38 v33.12,27.38
  Bottom 0.254: v33.12,27.38 30.88,29.62 11,29.62 7,33.62 4.38,33.62 3.17,34.83 CN3.9
PC3-LCD_DB3  (via drill 0.6)
  Top 0.254: IC6.11 36.12,28.62 34.12,26.62 33.62,26.62 v33.12,26.12
  Bottom 0.254: CN3.8 5.75,32.38 7.5,32.38 10.75,29.12 30.12,29.12 v33.12,26.12
PC4-LCD_DB4  (via drill 0.6)
  Top 0.254: IC6.24 43.62,26 45,27.38 45.88,27.38 46.38,26.88 v48,26.88
  Bottom 0.254: v48,26.88 48.5,27.38 48.5,30.38 45.88,33 43.25,33 41.12,30.88 41.12,29.62 40.75,29.25 39.5,29.25 35.5,25.25 24.12,25.25 20.75,28.62 10.5,28.62 8,31.12 4.38,31.12 CN3.7
PC5-LCD_DB5  (via drill 0.6)
  Top 0.254: v45.5,26.5 44.12,25.12 IC6.25
  Bottom 0.254: v45.5,26.5 46.38,26.5 48,28.12 48,30.12 45.62,32.5 43.5,32.5 41.62,30.62 41.62,29.38 41,28.75 39.75,28.75 35.75,24.75 23.88,24.75 20.5,28.12 10.25,28.12 8.62,29.75 5.75,29.75 CN3.6
PC6-LCD_DB6  (via drill 0.6)
  Top 0.254: v46.75,28.12 IC6.37
  Bottom 0.254: v46.75,28.12 47.5,28.88 47.5,29.88 45.38,32 43.75,32 42.12,30.38 42.12,29.12 41.25,28.25 40,28.25 36,24.25 23.62,24.25 20.25,27.62 10,27.62 9.12,28.5 4.5,28.5 3.21,29.79 CN3.5
PC7-LCD_DB7  (via drill 0.6)
  Top 0.254: v46.62,29.38 46.75,29.38 47.5,28.62 IC6.38
  Bottom 0.254: v46.62,29.38 46.62,30 45.12,31.5 44,31.5 42.62,30.12 42.62,28.88 41.5,27.75 40.25,27.75 36.25,23.75 23.38,23.75 20,27.12 5.75,27.12 CN3.4
PC8-LCD_RS  (via drill 0.6)
  Top 0.254: IC6.39 50.38,29.12 50.62,28.88 50.62,28.62 51.12,28.12 51.88,28.12 52.62,28.88 v52.62,29.62
  Bottom 0.254: v52.62,29.62 52.38,29.88 51.12,29.88 50.5,30.5 50.5,31.38 46.88,35 42.25,35 40.12,32.88 27.5,32.88 25.5,34.88 23.75,34.88 20.5,31.62 12,31.62 8.62,35 8.62,36 7.62,37 7.62,38 5.75,39.88 CN3.14
PC9-LCD_RD  (via drill 0.6)
  Top 0.254: v51.5,29 50.88,29.62 IC6.40
  Bottom 0.254: v51.5,29 50.75,29 50,29.75 50,31.12 46.62,34.5 42.5,34.5 40.38,32.38 27.25,32.38 25.25,34.38 24,34.38 20.75,31.12 11.75,31.12 8.12,34.75 8.12,35.75 7.25,36.62 6.5,36.62 CN3.12
PC10-LCD_WR  (via drill 0.6)
  Top 0.254: v46.62,37.5 IC6.51
  Bottom 0.254: v46.62,37.5 46.62,36.25 45.88,35.5 42,35.5 39.88,33.38 27.75,33.38 25.75,35.38 23.5,35.38 20.25,32.12 12.25,32.12 9.12,35.25 9.12,36.25 8.12,37.25 8.12,39.62 6.62,41.12 4.38,41.12 3.2,39.95 CN3.13
PC11-LCD_CS  (via drill 0.6)
  Top 0.254: v45.5,38.25 45.5,37.38 46.12,36.75 IC6.52
  Bottom 0.254: v45.5,38.25 45.5,37.25 44.62,36.38 42.12,36.38 39.62,33.88 28,33.88 26,35.88 23.25,35.88 20,32.62 12.5,32.62 9.62,35.5 9.62,36.5 8.62,37.5 8.62,39.88 6.01,42.49 CN3.16
PC12-LCD_RST  (via drill 0.6)
  Top 0.254: v44.12,37.25 44.88,37.25 45.62,36.5 IC6.53
  Bottom 0.254: v44.12,37.25 42.25,37.25 39.38,34.38 28.25,34.38 26.25,36.38 23,36.38 19.75,33.12 12.75,33.12 10.12,35.75 10.12,36.75 9.12,37.75 9.12,40.12 7.5,41.75 7.5,43 6.75,43.75 4.5,43.75 3.24,42.49 CN3.15
PC13-SYS_SHDN  (via drill 0.6)
  Top 0.254: IC6.2 36.75,33.12 35,34.88 v35,35.75
  Top 0.305: R3.2 10.75,23.75 | R3.2 10.78,23.75 | v12.25,35.5 12.25,29.5 9.5,26.75 9.5,24.12 9.88,23.75 10.62,23.75 R3.2 | IC1.6 14.95,24.21 14.62,24.54 13.32,24.54 12.51,23.73 10.89,23.73 R3.2
  Bottom 0.254: v35,35.75 34.12,34.88 28.5,34.88 26.5,36.88 22.75,36.88 19.5,33.62 13,33.62 12.25,34.38 v12.25,35.5
PC14-OSC32_IN
  Top 0.254: IC6.3 36.5,32.62 33.5,35.62 33.5,38.25 32.62,39.12 32.62,39.75 C24.1
  Top 0.61: C24.1 32.77,40.01 32.64,40.13 32.51,40.01 Q6.2
PC15-OSC32_OUT
  Top 0.254: C25.1 32.62,37.12 32.62,35.75 36.25,32.12 IC6.4
  Top 0.61: C25.1 32.5,37.38 29.25,37.38 Q6.1
PD1
  Top 0.61: CN6.4 73.03,10.29 72.9,10.41 73.03,10.54 R32.2
PD2
  Top 0.61: CN6.3 70.48,10.29 70.36,10.41 70.48,10.54 R33.2
PD2-SD_CS  (via drill 0.6)
  Top 0.254: R36.1 7.25,8 | IC6.54 45.12,32.88 43.62,31.38 43.62,29.88 v44,29.5
  Top 0.406: v10.5,10 8.5,8 7.38,8 R36.1 6.75,8 5.88,8 4.75,9.12 v4.7,9.14
  Top 0.61: R36.1
  Bottom 0.254: v10.5,10 14,6.5 43.25,6.5 44.5,7.75 44.5,11.25 39.88,15.88 39.88,20.25 41.25,21.62 41.25,22.88 43.62,25.25 43.62,29.12 v44,29.5
  Bottom 0.508: v4.7,9.14 4.62,9.13 1.1,9.13 CN2.2
POWER_BUT  (via drill 0.6)
  Top 0.305: R27.2 v18.29,25.78 18.2,25.68 17.55,25.02 16.41,25.02 16.25,25.19 IC1.1
  Top 0.406: S5.4 77.5,9 72.62,4.12 65.5,4.12 63.38,6.25 63.38,10.12 61.75,11.75 25.52,11.75 v25.14,11.37 | v24.25,14.88 v24.25,20.86
  Top 0.61: S5.4 77.47,9.27 83.82,9.27 S5.3
  Bottom 0.406: v24.25,20.86 24.25,22.11 SJ3.1 21.84,22.23 v18.29,25.78 | v24.25,14.88 25.14,13.99 v25.14,11.37
PU1
  Top 0.61: R35.1 65.41,10.54 65.28,10.41 65.41,10.29 CN6.1
PU2
  Top 0.61: CN6.2 67.94,10.29 67.82,10.41 67.94,10.54 R34.1
USB-DP  (via drill 0.6)
  Top 0.305: 28.19,43.18 R8.1 28.25,43.14 28.25,42 27.02,40.77 24.12,40.77 23.62,41.27 23.62,42.63 22.38,43.88 22.38,44.43 v22.35,44.45
  Top 0.406: R8.1 28.19,43.31 28.19,43.94 28.7,44.45 32.51,44.45 34.67,46.61 R21.2 | IC3.4 22.56,44.66 v22.35,44.45
  Bottom 0.406: SJ5.2 21.97,46.48 22.61,45.85 22.61,44.7 v22.35,44.45
VBAT  (via drill 0.6)
  Top 0.61: v20.19,48.9 19.05,48.9 16.13,51.82 16.13,56.26 16,56.39 14.86,56.39 D1.A 14.61,58.04 14.1,58.55 2.54,58.55 BAT1.+ 2.54,56.01 2.92,55.63 4.57,55.63 5.59,54.61 5.59,52.2 4.32,50.93 4.06,50.8 1.91,50.8 1.14,50.04 1.14,23.75 2.79,22.1 v13.21,22.1 | v35.81,45.47 37.47,45.47 R30.2 | R28.2 37.47,14.22 | R28.2 37.21,14.22 | R28.2 37.45,14.22 35.56,14.22 34.8,13.46 23.62,13.46 21.46,15.62 v21.46,19.56
  Bottom 0.61: v13.21,22.1 18.92,22.1 v21.46,19.56 | v35.81,45.47 29.97,51.31 22.61,51.31 v20.19,48.9
VBAT_BKP
  Top 0.254: IC6.1 37,33.62 36.12,34.5 36.12,43.38 36.25,43.5 37.38,43.5 R30.1
  Top 0.406: C13.1 42.55,43.43
  Top 0.61: R30.1 37.5,43.5 40,43.5 R31.2 40.25,43.5 42.38,43.5 C13.1
VCC  (via drill 0.6)
  Top 0.254: C17.1 37.75,39.75 37.75,39.12 40.12,36.75 IC6.64 | IC6.32 47.62,23 49.88,20.75 49.88,19.75 C15.1 | C18.1 39.75,19.88 39.75,20.88 41.12,22.25 IC6.19 | IC6.48 50.25,33.62 52.5,35.88 53.88,35.88 C16.1
  Top 0.381: IC2.4 14.3,40.95 14.3,39.75 | IC2.1 16.25,40.95 16.25,39.75
  Top 0.406: R6.2 19.68,39.75 | R24.2 37.72,49.28 37.59,49.4 35.94,49.4 35.43,49.91 33.78,49.91 33.66,50.04 Q4.C
  Top 0.61: CN5.2 CN5.1 71.5,26.67 | 71.5,28.57 R9.2 71.5,28.32 71.5,26.67 | R4.2 10.79,41.91 11.68,42.8 11.68,44.45 C3.1 11.5,44.5 7.88,44.5 | C14.A | C14.A 3.05,48.64 | L1.1 31.37,15.62 31.37,14.35 | R44.2 27.3,15.49 | R36.2 6.99,5.97 | 16.64,1.91 16.76,2.03 16.89,1.91 R37.1 14.1,1.91 12.32,3.68 12.32,6.5 | R38.1 30.23,1.91 30.1,2.03 29.97,1.91 27.43,1.91 25.65,3.68 25.65,6.5 | R39.1 43.56,1.91 43.43,2.03 43.31,1.91 40.64,1.91 38.99,3.56 38.99,6.5 | R40.1 56.9,1.91 56.77,2.03 56.64,1.91 53.85,1.91 52.32,3.43 | 67.94,13.72 R34.2 67.94,12.45 65.41,12.45 R35.2 65.15,12.45 63.75,12.45 63.12,13.08 60.58,13.08 v60.33,13.09 v60.33,13.08 58.29,15.11 58.29,16.26 | 67.94,13.72 67.94,16.64 70.74,19.43 70.74,20.7 R47.2 R46.2 70.74,23.75 70.74,24.89 71.5,25.65 71.5,26.67 | v4.89,6.92 5.84,5.97 6.73,5.97 R36.2 | C14.A 3.17,48.9 | 39.75,19.68 C18.1 39.75,19.43 39.75,18.03 39.24,17.53 36.2,17.53 35.18,16.51 35.18,15.11 34.42,14.35 31.37,14.35 | v38.73,46.74 37.85,46.74 37.72,46.86 37.72,48.13 R24.2 | v38.73,46.74 38.86,46.74 | C17.1 37.72,40.26 37.72,41.4 v38.73,42.42 | v38.73,46.74 40.77,46.74 41.02,46.99 v44.45,46.99 | 51.69,42.42 v51.56,42.42 53.88,40.1 53.88,36 C16.1 | v31.11,48.64 28.07,48.64 25.78,46.35 v25.78,45.21 | R6.2 19.81,39.75 | v21.08,42.29 19.68,40.89 R6.2 | v49.28,18.29 49.53,18.29 49.91,18.67 49.91,19.56 C15.1 | R36.2 7.25,6 8.5,6 9,6.5 12.32,6.5 | 12.32,6.5 25.65,6.5 | 25.65,6.5 38.99,6.5 | 38.99,6.5 52.32,6.5 52.32,3.43 | 67.94,13.72 75.82,13.72 76.83,12.7 CN4.1 | v25.27,17.14 25.27,15.88 25.65,15.49 27.05,15.49 R44.2 | R44.2 27.56,15.49 | R44.2 27.81,15.49 28.83,15.49 29.97,14.35 31.37,14.35
  Top 0.61: 52.32,3.43 v51.31,3.43 | 58.29,16.26 v58.29,19.81 | 58.29,16.26 v56.64,16.26 | 12.32,6.5 12.32,17.14 8.76,20.7 v5.71,20.7 | R4.2 10.78,39.75 | CN3.2 7.87,26.87 7.87,43.05 7.88,43.25 7.88,44.5 | 3.17,46.62 CN3.17 | 3.17,46.62 3.17,48.77 C14.A | 7.88,44.5 7.88,46 7.25,46.62 3.17,46.62 | R6.2 19.67,39.75 16.25,39.75 14.3,39.75 11.05,39.75 11.03,39.73 R4.2
  Bottom 0.406: v58.29,19.81 59.44,20.95 SJ7.2
  Bottom 0.61: CN3.2 v5.71,20.7 18.16,20.7 21.72,17.14 v25.27,17.14 | v44.45,46.99 SJ1.3 46.61,45.34 49.53,42.42 v51.56,42.42 | 38.73,44.45 v38.73,42.42 | 38.73,44.45 v38.73,46.74 | v31.11,48.64 35.31,44.45 38.73,44.45 | v21.08,42.29 24.13,42.29 25.78,43.94 v25.78,45.21 | v51.31,3.43 51.31,5.71 52.58,6.99 56.64,6.99 57.78,8.13 57.78,10.55 v60.33,13.09 | v56.64,16.26 50.55,16.26 49.28,17.53 v49.28,18.29 | v4.89,6.92 4.84,6.93 1.1,6.93 CN2.4
VCCA  (via drill 0.6)
  Top 0.381: C5.1 57.2,37.7 58.66,37.7 59.31,38.35 61.75,38.35 61.91,38.19 61.91,36.56 IC4.7 | C6.1 65.81,23.73 64.51,23.73 63.86,24.38 62.73,24.38 62.56,24.21 62.56,22.59 IC5.8
  Top 0.406: v59.69,35.56 57.66,35.56 57.15,36.07 C5.1 | v63.5,35.56 65.15,33.91 65.15,29.46 67.31,27.3 67.31,23.88 67.18,23.75 66.17,23.75 C6.1 65.91,23.62 v65.91,22.48
  Bottom 0.406: v63.5,35.56 v59.69,35.56 | v65.91,22.48 64.39,20.95 SJ7.1
VDDA
  Top 0.254: C19.1 33.38,22.38 33.38,24.25 36.75,27.62 IC6.13
  Top 0.406: C19.1 33.4,22.23 33.4,20.83 33.78,20.45 C20.A 33.78,18.92 33.78,17.4 33.4,17.02 33.4,15.88 L1.2
VIN
  Top 0.305: C2.1 18.85,44.2 18.85,42.74 18.69,42.58 16.25,42.58 15.6,41.92 15.6,41.11 IC2.2
  Top 0.381: R2.2 16.25,19.99 IC1.8
  Top 0.508: R2.2 17.9,19.68 21.29,23.07 21.29,26.49 18.04,29.74 18.04,33.78 22.35,38.1 22.35,38.57 22.34,38.58 D2.K
  Top 0.61: D1.K 14.61,51.94 16.64,49.91 16.64,48.51 C1.A 16.64,46.61 16.89,46.35 18.54,46.35 18.8,46.1 18.8,44.58 C2.1 20.45,44.45 22.35,42.55 22.35,42.16 D2.K | R2.2 16.25,19.5 16.25,18.25 27,7.5 60.62,7.5 60.83,7.49 66.42,1.91 79.5,1.91 79.63,2.03 79.76,1.91 R41.1
VSSA  (via drill 0.6)
  Top 0.254: IC6.12 36.5,28.12 31.38,23 31.38,22.38 C19.2
  Top 0.406: C19.2 31.37,20.83 30.99,20.45 30.99,19.3 C20.C
  Top 0.61: v28.83,19.05 C20.C
  Bottom 0.61: SJ2.2 v28.83,19.05
VUSB  (via drill 0.6)
  Top 0.406: 25.91,50.67 25.91,47.88 25.89,47.74 25.89,47.5 25.41,47.02 23.99,47.02 23.51,46.55 23.51,45.84 IC3.5 23.51,45.6 23.51,44.17 24.7,42.99 24.7,42.04 D2.A
  Top 0.508: CN1.1 25.1,52.9 25.1,51.5 25.8,50.8 25.91,50.67 26.1,50.7 28.9,50.7 30.7,52.5 30.7,54 32.7,56 32.7,56.9 R22.1
  Top 0.61: R25.1 47.62,45.47 46.48,45.47 46.42,45.53 46.42,46.48 42.16,50.74 42.16,53.85 | 42.16,53.85 42.16,57.09 40.64,58.61 32.96,58.61 32.64,58.29 32.64,57.34 32.7,57.2 R22.1 | v68.71,57.28 69.98,58.55 80.9,58.55 v82.17,57.28 | 42.16,53.85 v44.45,53.85
  Bottom 0.61: v44.45,53.85 67.06,53.85 68.71,55.5 v68.71,57.28 | v82.17,57.28 84.33,55.12 84.33,37.34 CN5.6

## Text on the board
tPlace: SGN101-V4P0 | YANTRONIX | www.yantronix.com
bPlace: SGN101-V4P0 | YANTRONIX | www.yantronix.com